# Altium schematic sheet Pag2_Battery_Charger.SchDoc: Carregador de Bateria
size A3; DocumentNumber: 1; Revision: V1.0; SheetNumber: 1; SheetTotal: 13
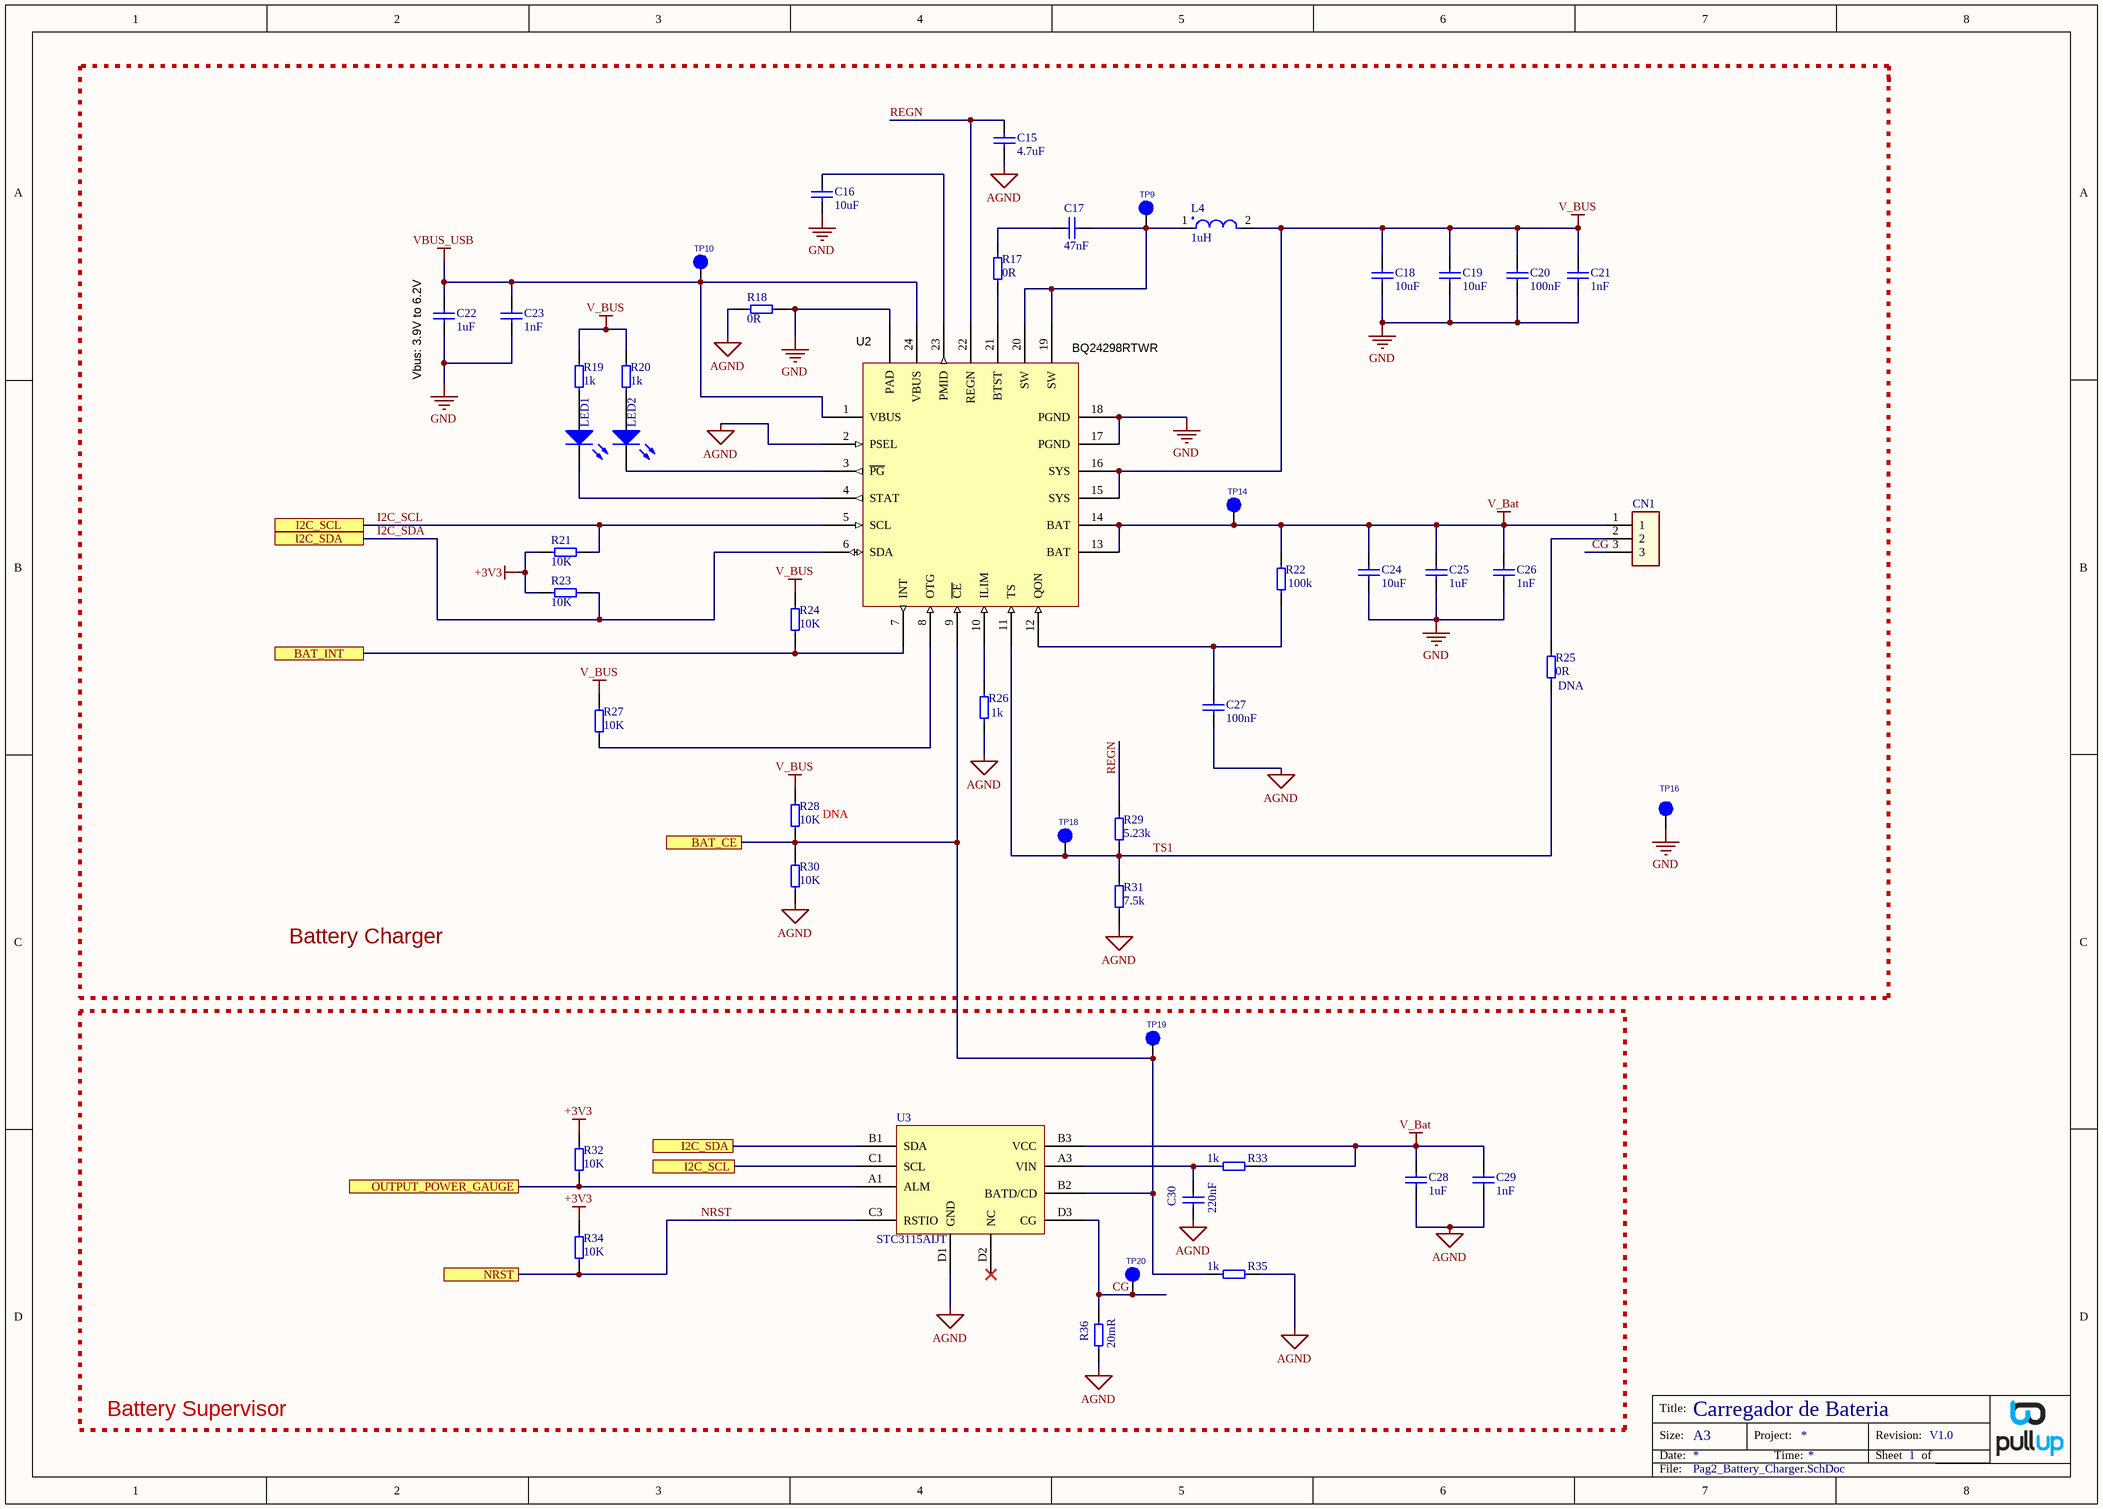
[diagram p0: Pag2_Battery_Charger.SchDoc]

## Parts
C15  4.7uF  [0603]
C16  10uF  [0603]
C17  47nF  [0603]
C18  10uF  [0603]
C19  10uF  [0603]
C20  100nF  [0603]
C21  1nF  [0603]
C22  1uF  [0603]
C23  1nF  [0603]
C24  10uF  [0603]
C25  1uF  [0603]
C26  1nF  [0603]
C27  100nF  [0603]
C28  1uF  [0603]
C29  1nF  [0603]
C30  220nF  [0603]
CN1  (no value)  [HDR1X3 Large]
L4  1uH  [SRP4012TA]
LED1  LED Green  [0603 - led]  (value not drawn)
LED2  LED Green  [0603 - led]  (value not drawn)
R17  0R  [0603]
R18  0R  [1218]
R19  1k  [0603]
R20  1k  [0603]
R21  10K  [0603]
R22  100k  [0603]
R23  10K  [0603]
R24  10K  [0603]
R25  0R  PCBA: DNA  [0603]
R26  1k  [0603]
R27  10K  [0603]
R28  10K  PCBA: DNA  [0603]
R29  5.23k  [0603]
R30  10K  [0603]
R31  7.5k  [0603]
R32  10K  [0603]
R33  1k  [0603]
R34  10K  [0603]
R35  1k  [0603]
R36  20mR  [0805]
TP9  Test_Point  [TEST]  (value not drawn)
TP10  Test_Point  [TEST]  (value not drawn)
TP14  Test_Point  [TEST]  (value not drawn)
TP16  Test_Point  [TEST]  (value not drawn)
TP18  Test_Point  [TEST]  (value not drawn)
TP19  Test_Point  [TEST]  (value not drawn)
TP20  Test_Point  [TEST]  (value not drawn)
U2  BQ24298RTWR  [WQFN-24]
U3  STC3115AIJT  [CSP1.4X2.04]

## Blocks framed on the sheet
Battery Supervisor: C28-C30 R32-R36 TP19 TP20 U3

## Ports
BAT_CE, BAT_INT, I2C_SCL, I2C_SDA, NRST, OUTPUT_POWER_GAUGE

## Nets
+3V3: R21.2 R23.2 R32.1 R34.1
AGND: C15.1 C27.1 C28.1 C29.1 C30.1 R18.1 R26.1 R30.2 R31.1 R35.1 R36.2 U2.2(PSEL) U3.D1(GND)
GND: C16.1 C18.1 C19.1 C20.1 C21.1 C22.1 C23.1 C24.1 C25.1 C26.1 R18.2 TP16.1(Pin1) U2.17(PGND) U2.18(PGND) U2.25(PAD)
V_Bat: C24.2 C25.2 C26.2 C28.2 C29.2 CN1.1 R22.1 R33.1 TP14.1(Pin1) U2.13(BAT) U2.14(BAT) U3.B3(VCC)
V_BUS: C18.2 C19.2 C20.2 C21.2 L4.2 R19.2 R20.2 R24.1 R27.1 R28.1 U2.15(SYS) U2.16(SYS)
VBUS_USB: C22.2 C23.2 TP10.1(Pin1) U2.1(VBUS) U2.24(VBUS)
BAT_CE: R28.2 R30.1 R35.2 TP19.1(Pin1) U2.9(~{CE}) U3.B2(BATD/CD) ; port BAT_CE
BAT_INT: R24.2 U2.7(INT) ; port BAT_INT
CG: CN1.3 R36.1 TP20.1(Pin1) U3.D3(CG)
I2C_SCL: R21.1 U2.5(SCL) U3.C1(SCL) ; port I2C_SCL
I2C_SDA: R23.1 U2.6(SDA) U3.B1(SDA) ; port I2C_SDA
NRST: R34.2 U3.C3(RSTIO) ; port NRST
OUTPUT_POWER_GAUGE: R32.2 U3.A1(ALM) ; port OUTPUT_POWER_GAUGE
REGN: C15.2 R29.2 U2.22(REGN)
TS1: R25.2 R29.1 R31.2 TP18.1(Pin1) U2.11(TS)
NetC16_2: C16.2 U2.23(PMID)
NetC17_1: C17.1 L4.1 TP9.1(Pin1) U2.19(SW) U2.20(SW)
NetC17_2: C17.2 R17.2
NetC27_2: C27.2 R22.2 U2.12(QON)
NetC30_2: C30.2 R33.2 U3.A3(VIN)
NetCN1_2: CN1.2 R25.1
NetLED1_1: LED1.1(A) R19.1
NetLED1_2: LED1.2(K) U2.4(STAT)
NetLED2_1: LED2.1(A) R20.1
NetLED2_2: LED2.2(K) U2.3(~{PG})
NetR17_1: R17.1 U2.21(BTST)
NetR26_2: R26.2 U2.10(ILIM)
NetR27_2: R27.2 U2.8(OTG)

Not connected (* = marked no-connect by the designer): U3 D2(NC)*

## Notes on the sheet
- (near C22) Vbus: 3.9V to 6.2V
- Battery Charger
- Title:
- Size:
- Date:
- A3
- Project:
- Time:
- Revision:
- Sheet
- of
- File:

## Library data of the parts
C15 = CAP_4.7uF_16V: Multilayer Ceramic Capacitors MLCC - SMD/SMT 4.7uF 6.3V 0603 10%; Manufacturer: Taiyo Yuden; MPN: JMK105BBJ475MV-F; PCBA: Assembly; Moeda: Dólar; NCM: 85322410; Datasheet: https://www.mouser.com/datasheet/2/396/mlcc02_e-1307760.pdf; Value: 4.7uF; Link/Contato: https://octopart.com/jmk105bbj475mv-f-taiyo+yuden-19756710?r=sp; Supplier: Mouser
C16 C18 C19 C24 = CAP_10uF_10V: Multilayer Ceramic Capacitors MLCC - SMD/SMT 10uF 0603 10V 10%; Manufacturer: Murata Electronics; MPN: GRM188R61A106KE69D; PCBA: Assembly; Moeda: Dólar; NCM: 85322410; Datasheet: http://www.mouser.com/ds/2/281/c02e-2905.pdf; Value: 10uF; Link/Contato: https://octopart.com/grm188r61a106ke69d-murata-22851381?r=sp; Supplier: Mouser
C17 = CAP_4.7uF_16V: Multilayer Ceramic Capacitors MLCC - SMD/SMT 47nF 0603 16V 10%; Manufacturer: AVX; MPN: 0603YC473KAT2A; PCBA: Assembly; Moeda: Dólar; NCM: 85322410; Datasheet: http://www.mouser.com/ds/2/40/X7RDielectric-777024.pdf; Value: 47nF; Link/Contato: https://octopart.com/0603yc473kat2a-avx-42088465?r=sp; Supplier: Mouser
C20 C27 = CAP_100nF_10V: Multilayer Ceramic Capacitors MLCC - SMD/SMT 100nF 16V 0603 10%; Manufacturer: KEMET; MPN: C0603C104K4RACTU; PCBA: Assembly; Moeda: Dólar; NCM: 85322410; Datasheet: https://www.mouser.com/datasheet/2/212/KEM_C1023_X7R_AUTO_SMD-1093309.pdf; Value: 100nF; Link/Contato: https://octopart.com/c0603c104k4ractu-kemet-93067?r=sp; Supplier: Mouser
C21 C26 = CAP_1nF_16V: Multilayer Ceramic Capacitors MLCC - SMD/SMT 25V 1nF 0603 25V 5%; Manufacturer: Yageo; MPN: CC0603JRX7R8BB102; PCBA: Assembly; Moeda: Dólar; NCM: 85322410; Datasheet: https://www.mouser.com/datasheet/2/447/UPY-GPHC_X7R_6.3V-to-50V_18-1154002.pdf; Value: 1nF; Link/Contato: https://octopart.com/cc0603jrx7r8bb102-yageo-71334465?r=sp; Supplier: Mouser
C22 C28 = CAP_1uF: Multilayer Ceramic Capacitors MLCC - SMD/SMT 1uF 25V 0603 10%; Manufacturer: Samsung Electro-Mechanics; MPN: CL10A105KA8NNNC; PCBA: Assembly; Moeda: Dólar; NCM: 85322410; Datasheet: https://www.mouser.com/datasheet/2/585/MLCC-1837944.pdf; Value: 1uF; Link/Contato: https://octopart.com/cl10a105ka8nnnc-samsung-9300957?r=sp; Supplier: Mouser
C23 C29 = CAP_1nF: Multilayer Ceramic Capacitors MLCC - SMD/SMT 25V 1nF 0603 25V 5%; Manufacturer: Yageo; MPN: CC0603JRX7R8BB102; PCBA: Assembly; Moeda: Dólar; NCM: 85322410; Datasheet: https://www.mouser.com/datasheet/2/447/UPY-GPHC_X7R_6.3V-to-50V_18-1154002.pdf; Value: 1nF; Link/Contato: https://octopart.com/cc0603jrx7r8bb102-yageo-71334465?r=sp; Supplier: Mouser
C25 = CAP_1uF_16V: Multilayer Ceramic Capacitors MLCC - SMD/SMT 1uF 25V 0603 10%; Manufacturer: Samsung Electro-Mechanics; MPN: CL10A105KA8NNNC; PCBA: Assembly; Moeda: Dólar; NCM: 85322410; Datasheet: https://www.mouser.com/datasheet/2/585/MLCC-1837944.pdf; Value: 1uF; Link/Contato: https://octopart.com/cl10a105ka8nnnc-samsung-9300957?r=sp; Supplier: Mouser
C30 = CAP_1nF: Multilayer Ceramic Capacitors MLCC - SMD/SMT 220nF 0603 16V 10%; Manufacturer: Yageo; MPN: CC0603KRX7R7BB224; PCBA: Assembly; Moeda: Dólar; NCM: 85322410; Datasheet: https://www.mouser.com/datasheet/2/447/UPY-GPHC_X7R_6.3V-to-50V_18-1154002.pdf; Value: 220nF; Link/Contato: https://octopart.com/cc0603krx7r7bb224-yageo-6827757?r=sp; Supplier: Mouser
CN1 = 53254-0370: MPN: Header; PCBA: DNA; Value: DNA; NCM: 85366990
L4 = IC_1uH: Power Inductors - SMD 1uH 20% SMD 4012 AEC-Q200; Manufacturer: Bourns; MPN: SRP4012TA-1R0M; PCBA: Assembly; Value: 1uH 20%; Moeda: Dólar; NCM: 85045000; Datasheet: https://www.mouser.com/datasheet/2/54/rp4012ta-1391620.pdf; Link/Contato: https://octopart.com/srp4012ta-1r0m-bourns-47284976?r=sp; Supplier: Mouser
LED1 LED2 = CDE02104-C024: Standard LEDs - SMD Green, Water Clear 60mcd, 571nm; MPN: APG1608CGKC/T; Manufacturer: Kingbright; PCBA: Assembly; Value: APG1608CGKC/T; Moeda: Dólar; NCM: 85414121; Datasheet: http://www.mouser.com/ds/2/216/APG1608CGKC-T-76846.pdf; Link/Contato: https://octopart.com/apg1608cgkc%2Ft-kingbright-18895116?r=sp; Supplier: Mouser
R17 = Pullup_Res_0_0603_RES: Thick Film Resistors - SMD 0 Ohms 100 mW 0603 5%; MPN: RC0603JR-070RL; Manufacturer: Yageo; PCBA: Assembly; Moeda: Dólar; NCM: 85332120; Datasheet: https://www.mouser.com/datasheet/2/447/PYu-RC_Group_51_RoHS_L_10-1527934.pdf; Value: 0R; Link/Contato: https://octopart.com/rc0603jr-070rl-yageo-1241539?r=sp; Supplier: Mouser
R18 = RES_0R_1218: Thick Film Resistors - SMD 1watt zero ohm 1218; Manufacturer: Yageo; MPN: RCL12180000Z0EK; PCBA: Assembly; Moeda: Dólar; NCM: 85332120; Datasheet: http://www.mouser.com/ds/2/447/PYu-RC1218_51_RoHS_L_(3)-2499.pdf; Value: 0R; Link/Contato: https://octopart.com/rcl12180000z0ek-vishay-44522010?r=sp; Supplier: Mouser
R19 R20 R26 R33 R35 = Pullup_Res_1k_0603_RES: Thick Film Resistors - SMD 1 kOhms 100 mW 0603 5%; MPN: RC0603JR-071KL; Manufacturer: Yageo; PCBA: Assembly; Moeda: Dólar; NCM: 85332120; Datasheet: https://www.mouser.com/datasheet/2/447/PYu-RC_Group_51_RoHS_L_10-1527934.pdf; Value: 1K; Link/Contato: https://octopart.com/rc0603jr-071kl-yageo-55402888?r=sp; Supplier: Mouser
R21 R23 R24 R27 R30 R32 R34 = RES_10k: Thick Film Resistors - SMD 10 kOhms 100-200 mW 0603 1%; Manufacturer: Yageo; MPN: RC0603FR-1310KL; PCBA: Assembly; Moeda: Dólar; NCM: 85332120; Datasheet: https://www.mouser.com/datasheet/2/427/crcwce3-1223726.pdf; Value: 10K; Link/Contato: https://octopart.com/rc0603fr-1310kl-yageo-11543875?r=sp; Supplier: Mouser
R22 = Pullup_Res_100K_0603_RES: Thick Film Resistors - SMD 100 kOhms 0603 100mW 1%; MPN: RC0603FR-07100KL; Manufacturer: Yageo; PCBA: Assembly; Moeda: Dólar; NCM: 85332120; Datasheet: https://www.mouser.com/datasheet/2/447/PYu-RC_Group_51_RoHS_L_10-1527934.pdf; Value: 100k; Link/Contato: https://octopart.com/rc0603fr-07100kl-yageo-40946036?r=sp; Supplier: Mouser
R25 = Pullup_Res_0_0603_RES: Thick Film Resistors - SMD 0 Ohms 100 mW 0603 5%; MPN: RC0603JR-070RL; Manufacturer: Yageo; Moeda: Dólar; NCM: 85332120; Datasheet: https://www.mouser.com/datasheet/2/447/PYu-RC_Group_51_RoHS_L_10-1527934.pdf; Value: 0R; Link/Contato: https://octopart.com/rc0603jr-070rl-yageo-1241539?r=sp; Supplier: Mouser
R28 = RES_10k: Thick Film Resistors - SMD 10 kOhms 100-200 mW 0603 1%; Manufacturer: Yageo; MPN: RC0603FR-1310KL; Moeda: Dólar; NCM: 85332120; Datasheet: https://www.mouser.com/datasheet/2/427/crcwce3-1223726.pdf; Value: 10K; Link/Contato: https://octopart.com/rc0603fr-1310kl-yageo-11543875?r=sp; Supplier: Mouser
R29 = RES_5.23k: Thick Film Resistors - SMD 5.23 kOhms 100mW 0603 1%; Manufacturer: KOA; MPN: RK73H1JTTD5231F; PCBA: Assembly; Moeda: Dólar; NCM: 85332120; Datasheet: http://www.mouser.com/ds/2/219/RK73H-5715.pdf; Value: 5.23k; Link/Contato: https://octopart.com/rk73h1jttd5231f-koa+speer-2167069?r=sp; Supplier: Mouser
R31 = RES_31.6k: Thick Film Resistors - SMD 7.5 kOhms 100mW 0603 0.1%; Manufacturer: KOA Speer; MPN: RN73R1JTTD7501B25; PCBA: Assembly; Moeda: Dólar; NCM: 85332120; Datasheet: https://br.mouser.com/datasheet/2/219/RN73R-1544889.pdf; Value: 7.5k; Link/Contato: https://octopart.com/rn73r1jttd7501b25-koa+speer-99548049?r=sp; Supplier: Mouser
R36 = Pullup_Res_1k_0603_RES: Current Sense Resistors - SMD .20mOhm 1% 1/2W; MPN: CFN0603-FX-R020ELF; Manufacturer: Bourns; PCBA: Assembly; Moeda: Dólar; NCM: 85332120; Datasheet: https://br.mouser.com/datasheet/2/447/yageodocoutput-1518764.pdf; Value: 20mR; Link/Contato: https://octopart.com/cfn0603-fx-r020elf-bourns-118067148?r=sp; Supplier: Mouser
TP9 TP10 TP14 TP16 TP18-TP20 = CDO08200-9892: Manufacturer: DNA; Value: Test Point; MPN: Test_Point; PCBA: DNA
U2 = IC_BQ24298RTWT: Battery Management I2C Controlled Single Cell 3A USB Charger with NVDC Power Path and Adjustable Voltage USB OTG 24-WQFN; Manufacturer: Texas Instruments; PCBA: Assembly; Moeda: Dólar; NCM: 85423120; MPN: BQ24298RTWR; Datasheet: http://www.ti.com/general/docs/suppproductinfo.tsp?distId=26&gotoUrl=http%3A%2F%2Fwww.ti.com%2Flit%2Fgpn%2Fbq24298; Value: BQ24298RTWR; Link/Contato: https://octopart.com/bq24298rtwr-texas+instruments-57441481?r=sp; Supplier: Mouser
U3 = STC3100: Battery Management CONDITIONING & INTERFACES; Manufacturer: STMicroelectronics; PCBA: Assembly; Moeda: Dólar; NCM: 85423120; Datasheet: https://br.mouser.com/datasheet/2/389/stc3115-974248.pdf; MPN: STC3115AIJT; Value: STC3115AIJT; Link/Contato: https://octopart.com/stc3115aijt-stmicroelectronics-29487915?r=sp; Supplier: Mouser